# Altium schematic sheet Ethernet.SchDoc: 02290_Sonoma_Controller
size B; ApprovedBy: J Johnson; CheckedBy: J Johnson; Author: sdfasdfdfAEFfasdFfaF; DrawnBy: J Johnson; Organization: Opsero Electronic Design; Address1: 21-915 Av. Marguerite-Bourgeoys; Address2: Québec (QC); Address3: G1S 3X4; DocumentNumber: OP009-001-SCH; Revision: D-1; SheetNumber: 05; SheetTotal: 16; Tel1: (581) 308-8830; Tel2: (581) 308-8830; Project: 02290_Sonoma_Controller; CheckedDate: 2013-12-13; Sheet: Ethernet PHY; PageSetup: Record=PageOptions|CenterHorizontal=True|CenterVertical=True|PrintScale=1.08|XCorrection=1.00|YCorrection=1.00|PrintKind=0|BorderSize=5000000|LeftOffset=0|BottomOffset=0|Orientation=2|PaperLength=1000|PaperWidth=1000|Scale=100|PaperSource=7|PrintQuality=-4|MediaType=1|DitherType=10|PaperKind=Tabloid     [11 x 17 in]|PrintScaleMode=1; DrawDate: 2013-12-13; SchTitle: 02290_Sonoma_Controller; RevDescription: Replaced Q2,Q3 with STD16NF06LT4; RevDate: 2020-07-07; RevBy: J Johnson; RevDescription2: Added resistors to QSPI interface; ModifiedDate: 2020-07-07
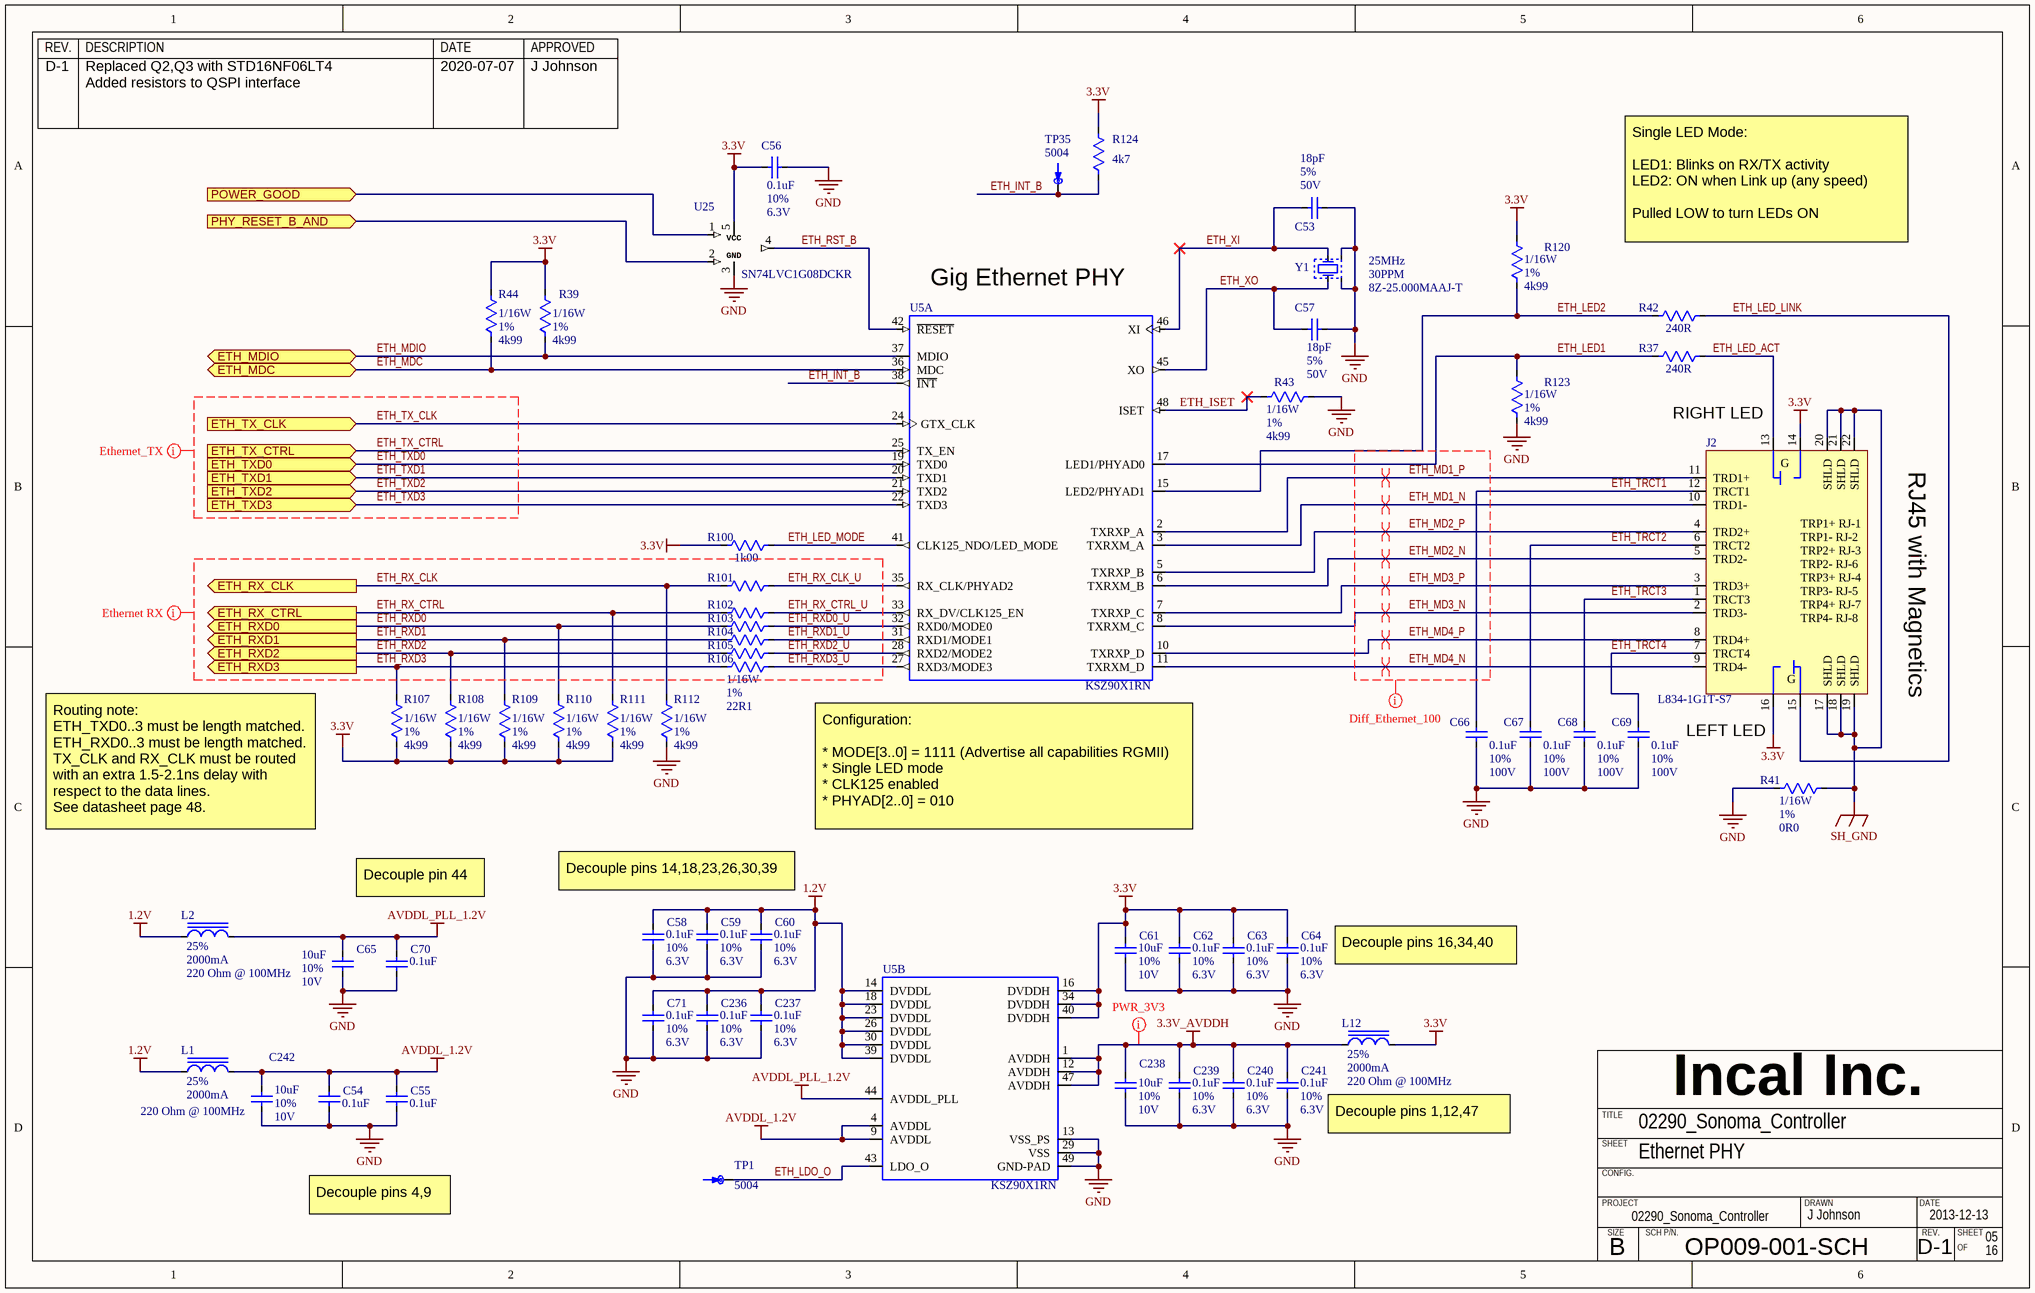
[diagram p0: Ethernet.SchDoc]

## Parts
C53  value 18pF  Tolerance: 5%  Voltage: 50V  [CAPC1005X33N]  (hidden comment: CAPACITOR_NP_TYPE1)
C54  value 0.1uF  [CAPC0603X33N]  (hidden comment: CAPACITOR_NP_TYPE1)
C55  value 0.1uF  [CAPC0603X33N]  (hidden comment: CAPACITOR_NP_TYPE1)
C56  value 0.1uF  Tolerance: 10%  Voltage: 6.3V  [CAPC0603X33N]  (hidden comment: CAPACITOR_NP_TYPE1)
C57  value 18pF  Tolerance: 5%  Voltage: 50V  [CAPC1005X33N]  (hidden comment: CAPACITOR_NP_TYPE1)
C58  value 0.1uF  Tolerance: 10%  Voltage: 6.3V  [CAPC0603X33N]  (hidden comment: CAPACITOR_NP_TYPE1)
C59  value 0.1uF  Tolerance: 10%  Voltage: 6.3V  [CAPC0603X33N]  (hidden comment: CAPACITOR_NP_TYPE1)
C60  value 0.1uF  Tolerance: 10%  Voltage: 6.3V  [CAPC0603X33N]  (hidden comment: CAPACITOR_NP_TYPE1)
C61  value 10uF  Tolerance: 10%  Voltage: 10V  [CAPC1608X38N]  (hidden comment: CAPACITOR_NP_TYPE1)
C62  value 0.1uF  Tolerance: 10%  Voltage: 6.3V  [CAPC0603X33N]  (hidden comment: CAPACITOR_NP_TYPE1)
C63  value 0.1uF  Tolerance: 10%  Voltage: 6.3V  [CAPC0603X33N]  (hidden comment: CAPACITOR_NP_TYPE1)
C64  value 0.1uF  Tolerance: 10%  Voltage: 6.3V  [CAPC0603X33N]  (hidden comment: CAPACITOR_NP_TYPE1)
C65  value 10uF  Tolerance: 10%  Voltage: 10V  [CAPC1608X38N]  (hidden comment: CAPACITOR_NP_TYPE1)
C66  value 0.1uF  Tolerance: 10%  Voltage: 100V  [CAPC1608X38N]  (hidden comment: CAPACITOR_NP_TYPE1)
C67  value 0.1uF  Tolerance: 10%  Voltage: 100V  [CAPC1608X38N]  (hidden comment: CAPACITOR_NP_TYPE1)
C68  value 0.1uF  Tolerance: 10%  Voltage: 100V  [CAPC1608X38N]  (hidden comment: CAPACITOR_NP_TYPE1)
C69  value 0.1uF  Tolerance: 10%  Voltage: 100V  [CAPC1608X38N]  (hidden comment: CAPACITOR_NP_TYPE1)
C70  value 0.1uF  [CAPC0603X33N]  (hidden comment: CAPACITOR_NP_TYPE1)
C71  value 0.1uF  Tolerance: 10%  Voltage: 6.3V  [CAPC0603X33N]  (hidden comment: CAPACITOR_NP_TYPE1)
C236  value 0.1uF  Tolerance: 10%  Voltage: 6.3V  [CAPC0603X33N]  (hidden comment: CAPACITOR_NP_TYPE1)
C237  value 0.1uF  Tolerance: 10%  Voltage: 6.3V  [CAPC0603X33N]  (hidden comment: CAPACITOR_NP_TYPE1)
C238  value 10uF  Tolerance: 10%  Voltage: 10V  [CAPC1608X38N]  (hidden comment: CAPACITOR_NP_TYPE1)
C239  value 0.1uF  Tolerance: 10%  Voltage: 6.3V  [CAPC0603X33N]  (hidden comment: CAPACITOR_NP_TYPE1)
C240  value 0.1uF  Tolerance: 10%  Voltage: 6.3V  [CAPC0603X33N]  (hidden comment: CAPACITOR_NP_TYPE1)
C241  value 0.1uF  Tolerance: 10%  Voltage: 6.3V  [CAPC0603X33N]  (hidden comment: CAPACITOR_NP_TYPE1)
C242  value 10uF  Tolerance: 10%  Voltage: 10V  [CAPC1608X38N]  (hidden comment: CAPACITOR_NP_TYPE1)
J2  value L834-1G1T-S7  [L834-1G1T-S7]  (hidden comment: CON_RJ45_MAG_TYPE_9)
L1  value 220 Ohm @ 100MHz  Tolerance: 25%  Current: 2000mA  [INDC2012X85N]  (hidden comment: INDUCTOR_CORE_TYPE1)
L2  value 220 Ohm @ 100MHz  Tolerance: 25%  Current: 2000mA  [INDC2012X85N]  (hidden comment: INDUCTOR_CORE_TYPE1)
L12  value 220 Ohm @ 100MHz  Tolerance: 25%  Current: 2000mA  [INDC2012X85N]  (hidden comment: INDUCTOR_CORE_TYPE1)
R37  value 240R  [RESC1005X33N]  (hidden comment: *)
R39  value 4k99  Power: 1/16W  Tolerance: 1%  [RESC1005X33N]  (hidden comment: *)
R41  value 0R0  Power: 1/16W  Tolerance: 1%  [RESC1005X33N]  (hidden comment: *)
R42  value 240R  [RESC1005X33N]  (hidden comment: *)
R43  value 4k99  Power: 1/16W  Tolerance: 1%  [RESC1005X33N]  (hidden comment: *)
R44  value 4k99  Power: 1/16W  Tolerance: 1%  [RESC1005X33N]  (hidden comment: *)
R100  value 1k00  [RESC1005X33N]  (hidden comment: *)
R101  *  [RESC1005X33N]  (value not drawn)
R102  *  [RESC1005X33N]  (value not drawn)
R103  *  [RESC1005X33N]  (value not drawn)
R104  *  [RESC1005X33N]  (value not drawn)
R105  *  [RESC1005X33N]  (value not drawn)
R106  value 22R1  Power: 1/16W  Tolerance: 1%  [RESC1005X33N]  (hidden comment: *)
R107  value 4k99  Power: 1/16W  Tolerance: 1%  [RESC1005X33N]  (hidden comment: *)
R108  value 4k99  Power: 1/16W  Tolerance: 1%  [RESC1005X33N]  (hidden comment: *)
R109  value 4k99  Power: 1/16W  Tolerance: 1%  [RESC1005X33N]  (hidden comment: *)
R110  value 4k99  Power: 1/16W  Tolerance: 1%  [RESC1005X33N]  (hidden comment: *)
R111  value 4k99  Power: 1/16W  Tolerance: 1%  [RESC1005X33N]  (hidden comment: *)
R112  value 4k99  Power: 1/16W  Tolerance: 1%  [RESC1005X33N]  (hidden comment: *)
R120  value 4k99  Power: 1/16W  Tolerance: 1%  [RESC1005X33N]  (hidden comment: *)
R123  value 4k99  Power: 1/16W  Tolerance: 1%  [RESC1005X33N]  (hidden comment: *)
R124  value 4k7  [RESC1005X33N]  (hidden comment: *)
TP1  value 5004  [KEY_5004]  (hidden comment: TEST_POINT_TYPE4)
TP35  value 5004  [KEY_5004]  (hidden comment: TEST_POINT_TYPE4)
U5  KSZ90X1RN  [QFN50P700X700X90-49N]  (value not drawn)  (parts A,B of 2)
U25  value SN74LVC1G08DCKR  [SOT65P210X110-5N]  (hidden comment: SN74LVC1G08)
Y1  value 25MHz  Tolerance: 30PPM  Mfg Part Number 1: 8Z-25.000MAAJ-T  [OSCSC185P200X250X55-4N]  (hidden comment: *)

## Ports
ETH_MDC (bidir), ETH_MDIO (bidir), ETH_RX_CLK (out), ETH_RX_CTRL (out), ETH_RXD0 (out), ETH_RXD1 (out), ETH_RXD2 (out), ETH_RXD3 (out), ETH_TX_CLK (in), ETH_TX_CTRL (in), ETH_TXD0 (in), ETH_TXD1 (in), ETH_TXD2 (in), ETH_TXD3 (in), PHY_RESET_B_AND (in), POWER_GOOD (in)

## Nets
1.2V: C58.1 C59.1 C60.1 C71.1 C236.1 C237.1 L1.1 L2.1 U5.14(DVDDL) U5.18(DVDDL) U5.23(DVDDL) U5.26(DVDDL) U5.30(DVDDL) U5.39(DVDDL)
3.3V: C56.1 C61.1 C62.1 C63.1 C64.1 J2.14(A2) J2.16(A1) L12.2 R39.2 R44.2 R100.1 R107.1 R108.1 R109.1 R110.1 R111.1 R120.2 R124.1 U5.16(DVDDH) U5.34(DVDDH) U5.40(DVDDH) U25.5(VCC)
3.3V_AVDDH: C238.1 C239.1 C240.1 C241.1 L12.1 U5.1(AVDDH) U5.12(AVDDH) U5.47(AVDDH)
AVDDL_1.2V: C54.1 C55.1 C242.1 L1.2 U5.4(AVDDL) U5.9(AVDDL)
AVDDL_PLL_1.2V: C65.1 C70.1 L2.2 U5.44(AVDDL_PLL)
GND: C53.2 C54.2 C55.2 C56.2 C57.2 C58.2 C59.2 C60.2 C61.2 C62.2 C63.2 C64.2 C65.2 C66.2 C67.2 C68.2 C69.2 C70.2 C71.2 C236.2 C237.2 C238.2 C239.2 C240.2 C241.2 C242.2 R41.1 R43.1 R112.1 R123.1 U5.13(VSS_PS) U5.29(VSS) U5.49(GND-PAD) U25.3(GND) Y1.2 Y1.4
SH_GND: J2.17(SHLD) J2.18(SHLD) J2.19(SHLD) J2.20(SHLD) J2.21(SHLD) J2.22(SHLD) R41.2
ETH_INT_B: R124.2 TP35.1 U5.38(~{INT})
ETH_ISET: R43.2 U5.48(ISET)
ETH_LDO_O: TP1.1 U5.43(LDO_O)
ETH_LED1: R37.1 R123.2 U5.17(LED1/PHYAD0)
ETH_LED2: R42.1 R120.1 U5.15(LED2/PHYAD1)
ETH_LED_ACT: J2.13(K2) R37.2
ETH_LED_LINK: J2.15 R42.2
ETH_LED_MODE: R100.2 U5.41(CLK125_NDO/LED_MODE)
ETH_MD1_N: J2.10(TRD1-) U5.3(TXRXM_A)
ETH_MD1_P: J2.11(TRD1+) U5.2(TXRXP_A)
ETH_MD2_N: J2.5(TRD2-) U5.6(TXRXM_B)
ETH_MD2_P: J2.4(TRD2+) U5.5(TXRXP_B)
ETH_MD3_N: J2.2(TRD3-) U5.8(TXRXM_C)
ETH_MD3_P: J2.3(TRD3+) U5.7(TXRXP_C)
ETH_MD4_N: J2.9(TRD4-) U5.11(TXRXM_D)
ETH_MD4_P: J2.8(TRD4+) U5.10(TXRXP_D)
ETH_MDC: R44.1 U5.36(MDC) ; port ETH_MDC
ETH_MDIO: R39.1 U5.37(MDIO) ; port ETH_MDIO
ETH_RST_B: U5.42(~{RESET}) U25.4(Y)
ETH_RX_CLK: R101.1 R112.2 ; port ETH_RX_CLK
ETH_RX_CLK_U: R101.2 U5.35(RX_CLK/PHYAD2)
ETH_RX_CTRL: R102.1 R111.2 ; port ETH_RX_CTRL
ETH_RX_CTRL_U: R102.2 U5.33(RX_DV/CLK125_EN)
ETH_RXD0: R103.1 R110.2 ; port ETH_RXD0
ETH_RXD0_U: R103.2 U5.32(RXD0/MODE0)
ETH_RXD1: R104.1 R109.2 ; port ETH_RXD1
ETH_RXD1_U: R104.2 U5.31(RXD1/MODE1)
ETH_RXD2: R105.1 R108.2 ; port ETH_RXD2
ETH_RXD2_U: R105.2 U5.28(RXD2/MODE2)
ETH_RXD3: R106.1 R107.2 ; port ETH_RXD3
ETH_RXD3_U: R106.2 U5.27(RXD3/MODE3)
ETH_TRCT1: C66.1 J2.12(TRCT1)
ETH_TRCT2: C67.1 J2.6(TRCT2)
ETH_TRCT3: C68.1 J2.1(TRCT3)
ETH_TRCT4: C69.1 J2.7(TRCT4)
ETH_TX_CLK: U5.24(GTX_CLK) ; port ETH_TX_CLK
ETH_TX_CTRL: U5.25(TX_EN) ; port ETH_TX_CTRL
ETH_TXD0: U5.19(TXD0) ; port ETH_TXD0
ETH_TXD1: U5.20(TXD1) ; port ETH_TXD1
ETH_TXD2: U5.21(TXD2) ; port ETH_TXD2
ETH_TXD3: U5.22(TXD3) ; port ETH_TXD3
ETH_XI: C53.1 U5.46(XI) Y1.3
ETH_XO: C57.1 U5.45(XO) Y1.1
PHY_RESET_B_AND: U25.2(B) ; port PHY_RESET_B_AND
POWER_GOOD: U25.1(A) ; port POWER_GOOD

## Layout directives
differential pair: ETH_MD1_N, ETH_MD1_P, ETH_MD2_N, ETH_MD2_P, ETH_MD3_N, ETH_MD3_P, ETH_MD4_N, ETH_MD4_P
net class Power_3V3: 3.3V_AVDDH
net class Ethernet_TX: ETH_TX_CLK, ETH_TX_CTRL, ETH_TXD0, ETH_TXD1, ETH_TXD2, ETH_TXD3
net class Ethernet RX: ETH_RX_CLK, ETH_RX_CLK_U, ETH_RX_CTRL, ETH_RX_CTRL_U, ETH_RXD0, ETH_RXD0_U, ETH_RXD1, ETH_RXD1_U, ETH_RXD2, ETH_RXD2_U, ETH_RXD3, ETH_RXD3_U
net class Diff_Ethernet_100: ETH_MD1_N, ETH_MD1_P, ETH_MD2_N, ETH_MD2_P, ETH_MD3_N, ETH_MD3_P, ETH_MD4_N, ETH_MD4_P

## Notes on the sheet
- Single LED Mode:
  LED1: Blinks on RX/TX activity
  LED2: ON when Link up (any speed)
  Pulled LOW to turn LEDs ON
- (near U5) Gig Ethernet PHY
- (near J2) RIGHT LED
- (near J2) RJ45 with Magnetics
- (near J2) LEFT LED
- Routing note:
  ETH_TXD0..3 must be length matched.
  ETH_RXD0..3 must be length matched.
  TX_CLK and RX_CLK must be routed with an extra 1.5-2.1ns delay with respect to the data lines.
  See datasheet page 48.
- (near U5) Configuration:
  * MODE[3..0] = 1111 (Advertise all capabilities RGMII)
  * Single LED mode
  * CLK125 enabled
  * PHYAD[2..0] = 010
- Decouple pin 44
- Decouple pins 14,18,23,26,30,39
- (near C64) Decouple pins 16,34,40
- Decouple pins 1,12,47
- Decouple pins 4,9
- REV.
- DESCRIPTION
- DATE
- APPROVED
- Incal Inc.
- SHEET
- TITLE
- CONFIG.
- PROJECT
- SIZE
- SCH P/N.
- DRAWN
- B
- OF
- (in symbol L834-1G1T-S7) G; TRP1+ RJ-1; TRP1- RJ-2; TRP2+ RJ-3; TRP2- RJ-6; TRP3+ RJ-4; TRP3- RJ-5; TRP4+ RJ-7; TRP4- RJ-8

## Library data of the parts
C53 C57 = C0402_18pF_5%_50V_C0G: Capacitor ceramic, C0G (NP0), 18pF, 50V, 5%, -55 to +125 C, EIA0402; Manufacturer 1: Murata; Mfg Part Number 1: GRM1555C1H180JZ01D; EIA(I) Package: 0402; EIA(M) Package: 1005; ASSY: USED; Status: Active; Power: *; Current: *; Part Ref: C0402_18pF_5%_50V_C0G; Comment_1: *; RoHs: True; Operating Temp: -55 to +125 C; Datasheet 1: ..\datasheet\Capacitor\Murata\GRM_Serie\Series catalog\2013-04-30
C54-C56 C58-C60 C62-C64 C70 C71 C236 C237 C239-C241 = C0201_0.1uF_10%_6.3V_X5R: Capacitor ceramic, X5R, 0.1uF, 6.3V, 10%, -55 to +125 C, EIA0201; Manufacturer 1: Murata; Mfg Part Number 1: GRM033R60J104KE19D; EIA(I) Package: 0201; EIA(M) Package: 0603; ASSY: USED; Status: Active; Power: *; Current: *; Part Ref: C0201_0.1uF_10%_6.3V_X5R; Comment_1: *; RoHs: True; Operating Temp: -55 to +85 C
  C54 C55 C70: Tolerance: 10%; Voltage: 6.3V
C61 C65 C238 C242 = C0603_10uF_10%_10V_X5R: Capacitor ceramic, X5R, 10uF, 10V, 10%, -55 to +85 C, EIA0603; Manufacturer 1: TDK Corporation; Mfg Part Number 1: C1608X5R1A106K080AC; EIA(I) Package: 0603; EIA(M) Package: 1608; ASSY: USED; Status: Active; Power: *; Current: *; Part Ref: C0603_10uF_10%_10V_X5R; Comment_1: *; RoHs: True; Operating Temp: -55 to +85 C
C66-C69 = C0603_0.1uF_10%_100V_X7R: Capacitor ceramic, X7R, 0.1uF, 100V, 10%, -55 to +125 C, EIA0603; Manufacturer 1: Murata; Mfg Part Number 1: GRM188R72A104KA35D; EIA(I) Package: 0603; EIA(M) Package: 1608; ASSY: USED; Status: Active; Power: *; Current: *; Part Ref: C0603_0.1uF_10%_100V_X7R; Comment_1: *; RoHs: True; Operating Temp: -55 to +125 C; Datasheet 1: ..\datasheet\Capacitor\Murata\GRM_Serie\GRM188R72A_X7R\2012-06-24
J2 = L834-1G1T-S7: Connector RJ45, 10/100/1000, with Mag & 2 LED G/G, Tab down; Manufacturer 1: Bel Fuse; Status: Active; EIA(I) Package: *; EIA(M) Package: *; Part Ref: L834-1G1T-S7; Tolerance: *; Package: *; RoHs: True; Datasheet 1: https://www.belfuse.com/resources/ICMs/ICMs%20Drawings/L834-1G1T-S7.pdf; Mfg Part Number 1: L834-1G1T-S7; Operating Temp: -
L1 L2 L12 = BLM21PG221SN1D: Ferrite chip, 220 Ohm @ 100MHz, 2000mA, 25%, -55 to +125 C, 0805; Manufacturer 1: Murata; EIA(I) Package: 0805; EIA(M) Package: 2012; ASSY: USED; Status: Active; Power: *; Part Ref: BLM21PG221SN1D; Voltage: *; Comment_1: *; RoHs: True; Operating Temp: -55 to +125 C; Mfg Part Number 1: BLM21PG221SN1D
R37 R42 = R0402_240R_1%: Resistor, 240R, 1/16W, 1%, -50 to +155 C, EIA0402, EIA(M)1005; Manufacturer 1: Vishay Dale; Mfg Part Number 1: CRCW0402240RFKED; EIA(I) Package: 0402; EIA(M) Package: 1005; Voltage: 50V; ASSY: USED; Status: Active; Part Ref: R0402_240R_1%; Current: *; Comment_1: *; RoHs: True; Power: 1/16W; Tolerance: 1%; Operating Temp: -50 to +155 C
R39 R43 R44 R107-R112 R120 R123 = R0402_4k99_1%: Resistor, 4k99, 1/16W, 1%, -50 to +155 C, EIA0402, EIA(M)1005; Manufacturer 1: Yageo; Mfg Part Number 1: RC0402FR-074k99L; EIA(I) Package: 0402; EIA(M) Package: 1005; Voltage: 50V; ASSY: USED; Status: Active; Part Ref: R0402_4k99_1%; Current: *; Comment_1: *; RoHs: True; Operating Temp: -50 to +155 C; Datasheet 1: ..\datasheet\Resistor\Yaego\Thick_Film\RC0402\2012-03-29; Manufacturer 2: Vishay Dale; Mfg Part Number 2: CRCW04024k99FKED; Datasheet 2: ..\datasheet\Resistor\Vishay Dale\CRC\2012-03-29
R41 = R0402_0R0_1%: Resistor, 0R0, 1/16W, 1%, -50 to +155 C, EIA0402, EIA(M)1005; Manufacturer 1: Yageo; Mfg Part Number 1: RC0402FR-070RL; EIA(I) Package: 0402; EIA(M) Package: 1005; Voltage: 50V; ASSY: USED; Status: Active; Part Ref: R0402_0R0_1%; Current: *; Comment_1: *; RoHs: True; Package: 0402; Operating Temp: -50 to +155 C; Datasheet 1: ..\datasheet\Resistor\Yaego\Thick_Film\RC0402\2012-03-29; Manufacturer 2: Rohm Semiconductor; Mfg Part Number 2: MCR01MRTJ000; Datasheet 2: ..\datasheet\Resistor\Rohm\2012-08-20
R100 = R0402_1k00_1%: Resistor, 1k00, 1/16W, 1%, -55 to +155 C, EIA0402; Manufacturer 1: Yageo; Mfg Part Number 1: RC0402FR-071K00L; EIA(I) Package: 0402; EIA(M) Package: 1005; Voltage: 50V; ASSY: USED; Status: Active; Part Ref: R0402_1k00_1%; Current: *; Comment_1: *; RoHs: True; Power: 1/16W; Tolerance: 1%; Operating Temp: -55 to +155 C; Datasheet 1: ..\datasheet\Resistor\Yaego\Thick_Film\RC0402\2012-03-29; Manufacturer 2: Vishay Dale; Mfg Part Number 2: CRCW04021k00FKED; Datasheet 2: ..\datasheet\Resistor\Vishay Dale\CRC\2012-03-29
R101-R106 = R0402_22R1_1%: Resistor, 22R1, 1/16W, 1%, -55 to +155 C, EIA0402; Manufacturer 1: Yageo; Mfg Part Number 1: RC0402FR-0722R1L; EIA(I) Package: 0402; EIA(M) Package: 1005; Voltage: 50V; ASSY: USED; Status: Active; Part Ref: R0402_22R1_1%; Current: *; Comment_1: *; RoHs: True; Operating Temp: -55 to +155 C; Datasheet 1: ..\datasheet\Resistor\Yaego\Thick_Film\RC0402\2012-03-29; Manufacturer 2: Vishay Dale; Mfg Part Number 2: CRCW040222R1FKED; Datasheet 2: ..\datasheet\Resistor\Vishay Dale\CRC\2012-03-29
  R101-R105: Power: 1/16W; Tolerance: 1%; Value: 22R1
R124 = R0402_4k70_1%: Resistor, 4k7, 1/16W, 1%, -55 to +155 C, EIA0402; Manufacturer 1: Yageo; Mfg Part Number 1: RC0402FR-074k7L; EIA(I) Package: 0402; EIA(M) Package: 1005; Voltage: 50V; ASSY: USED; Status: Active; Part Ref: R0402_4k70_1%; Current: *; Comment_1: *; RoHs: True; Power: 1/16W; Tolerance: 1%; Operating Temp: -55 to +155 C; Datasheet 1: ..\datasheet\Resistor\Yaego\Thick_Film\RC0402\2012-03-29; Manufacturer 2: Vishay Dale; Mfg Part Number 2: CRCW04024k70FKED; Datasheet 2: ..\datasheet\Resistor\Vishay Dale\CRC\2012-03-29
TP1 TP35 = 5004: Test point bead, yellow, Keystone Electronics, Thru-hole,; Manufacturer 1: Keystone inc; ASSY: USED; Power: Pow; Current: Cur; Voltage: Vol; Comment_1: Com; Status: Active; EIA(I) Package: *; EIA(M) Package: *; Part Ref: 5004; Tolerance: *; Package: *; RoHs: True; Mfg Part Number 1: 5004; Datasheet 1: ..\datasheet\Connector\Keystone Electronics\5001-5014\2012-06-28
U5 = KSZ9021RNI: 10/100/1000 ethernet PHY with RGMII, 3.3V,1.2V, 0, -40 to +85 C, 0, QFN48; Manufacturer 1: Micrel; ASSY: USED; Power: 0; Status: Active; EIA(I) Package: *; EIA(M) Package: *; Part Ref: KSZ9021RNI; Current: 0; Tolerance: *; Voltage: 3.3V,1.2V; Package: QFN48; RoHs: True; Value: KSZ9021RNI; Operating Temp: -40 to +85 C; Mfg Part Number 1: KSZ9021RNI; Datasheet 1: ..\datasheet\Interface\KSZ9031RNX\2012-10-18; Manufacturer 2: MICREL; Mfg Part Number 2: KSZ9021RNI; Datasheet 2: ..\datasheet\Interface\KSZ9021RN\2012-10-18
U25 = SN74LVC1G08DCKR: Single 2-input AND gate, 1.65V to 5.5V; Manufacturer 1: Texas Instruments; ASSY: USED; Power: Pow; Current: Cur; Comment_1: Com; Status: Active; EIA(I) Package: *; EIA(M) Package: *; Part Ref: SN74LVC1G08DCKR; Tolerance: *; Voltage: 1.65V to 5.5V; Package: SC70-5; RoHs: True; Operating Temp: -40 to 125 C; Mfg Part Number 1: SN74LVC1G08DCKR
Y1 = 8Z-25.000MAAJ-T: Crystal, 25MHz, 30ppm, 100uW, -40 to +85 C, SMT; Manufacturer 1: TXC; ASSY: USED; Status: Active; EIA(I) Package: *; EIA(M) Package: *; Part Ref: 8Z-25.000MAAJ-T; Voltage: *; Current: *; Power: 100uW; Comment_1: *; RoHs: True; Package: 2.0x2.5x0.55mm; Operating Temp: -40 to +85 C